# EAGLE design Sch_v5 (EAGLE 9.6.2)
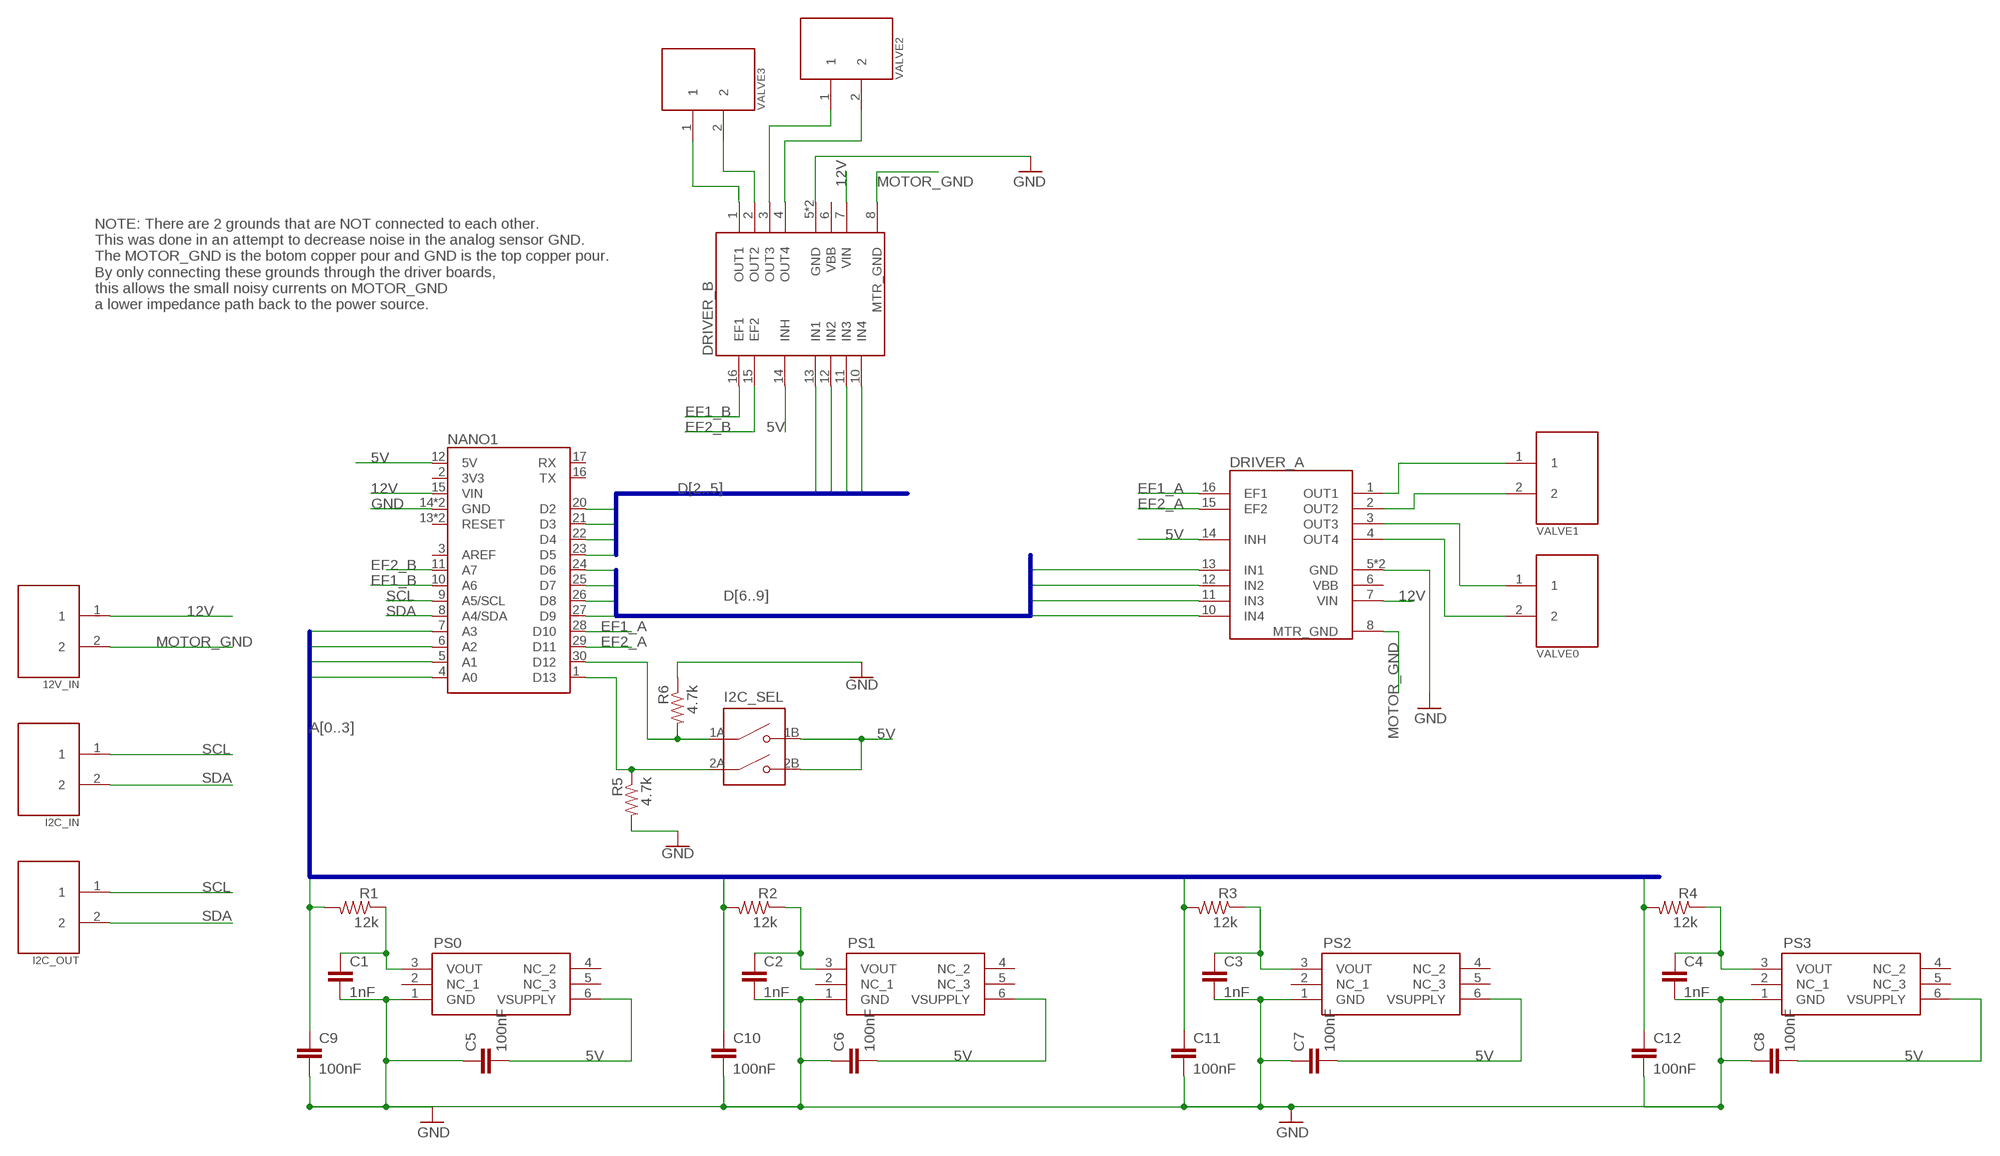
[diagram p0: schematic, sheet 1]

## Parts
12V_IN  PHOENIX_CONNECTOR_1778625  [PHOENIX_CONNECTOR_1778625]
C1  1nF  CERAMIC_CAPACITOR  [CERAMIC_CAPACITOR]
C2  1nF  CERAMIC_CAPACITOR  [CERAMIC_CAPACITOR]
C3  1nF  CERAMIC_CAPACITOR  [CERAMIC_CAPACITOR]
C4  1nF  CERAMIC_CAPACITOR  [CERAMIC_CAPACITOR]
C5  100nF  CERAMIC_CAPACITOR  [CERAMIC_CAPACITOR]
C6  100nF  CERAMIC_CAPACITOR  [CERAMIC_CAPACITOR]
C7  100nF  CERAMIC_CAPACITOR  [CERAMIC_CAPACITOR]
C8  100nF  CERAMIC_CAPACITOR  [CERAMIC_CAPACITOR]
C9  100nF  CERAMIC_CAPACITOR  [CERAMIC_CAPACITOR]
C10  100nF  CERAMIC_CAPACITOR  [CERAMIC_CAPACITOR]
C11  100nF  CERAMIC_CAPACITOR  [CERAMIC_CAPACITOR]
C12  100nF  CERAMIC_CAPACITOR  [CERAMIC_CAPACITOR]
DRIVER_A  A4990_DUAL_MOTOR_DRIVER_CARRIER  [A4990_DUAL_MOTOR_DRIVER_CARRIER]
DRIVER_B  A4990_DUAL_MOTOR_DRIVER_CARRIER  [A4990_DUAL_MOTOR_DRIVER_CARRIER]
I2C_IN  PHOENIX_CONNECTOR_1778625  [PHOENIX_CONNECTOR_1778625]
I2C_OUT  PHOENIX_CONNECTOR_1778625  [PHOENIX_CONNECTOR_1778625]
I2C_SEL  2PIN_DIP_DS01-254-S-02BE  [2PIN_DIP_DS01-254-S-02BE]
NANO1  ARDUINO_NANO_EVERY  [ARDUINO_NANO_EVERY]
PS0  PRESSURE_SENSOR_ABPDRNN100PGAA5  [PRESSURE_SENSOR_ABPDRNN100PGAA5]
PS1  PRESSURE_SENSOR_ABPDRNN100PGAA5  [PRESSURE_SENSOR_ABPDRNN100PGAA5]
PS2  PRESSURE_SENSOR_ABPDRNN100PGAA5  [PRESSURE_SENSOR_ABPDRNN100PGAA5]
PS3  PRESSURE_SENSOR_ABPDRNN100PGAA5  [PRESSURE_SENSOR_ABPDRNN100PGAA5]
R1  12k  R-US_0204/7  [0204/7]
R2  12k  R-US_0204/7  [0204/7]
R3  12k  R-US_0204/7  [0204/7]
R4  12k  R-US_0204/7  [0204/7]
R5  4.7k  R-US_0204/7  [0204/7]
R6  4.7k  R-US_0204/7  [0204/7]
VALVE0  PHOENIX_CONNECTOR_1778625  [PHOENIX_CONNECTOR_1778625]
VALVE1  PHOENIX_CONNECTOR_1778625  [PHOENIX_CONNECTOR_1778625]
VALVE2  PHOENIX_CONNECTOR_1778625  [PHOENIX_CONNECTOR_1778625]
VALVE3  PHOENIX_CONNECTOR_1778625  [PHOENIX_CONNECTOR_1778625]

## Nets
5V [Power]: C5.2 C6.2 C7.2 C8.2 DRIVER_A.14(INH) DRIVER_B.14(INH) I2C_SEL.1B(NO1) I2C_SEL.2B(NO2) NANO1.12(5V) PS0.6(VSUPPLY) PS1.6(VSUPPLY) PS2.6(VSUPPLY) PS3.6(VSUPPLY)
12V [Motor Power]: 12V_IN.1 DRIVER_A.7(VIN) DRIVER_B.7(VIN) NANO1.15(VIN)
A0 [Analog Signal]: C9.1 NANO1.4(A0) R1.2
A1 [Analog Signal]: C10.1 NANO1.5(A1) R2.2
A2 [Analog Signal]: C11.1 NANO1.6(A2) R3.2
A3 [Analog Signal]: C12.1 NANO1.7(A3) R4.2
D2: DRIVER_B.13(IN1) NANO1.20(D2)
D3: DRIVER_B.12(IN2) NANO1.21(D3)
D4: DRIVER_B.11(IN3) NANO1.22(D4)
D5: DRIVER_B.10(IN4) NANO1.23(D5)
D6: DRIVER_A.13(IN1) NANO1.24(D6)
D7: DRIVER_A.12(IN2) NANO1.25(D7)
D8: DRIVER_A.11(IN3) NANO1.26(D8)
D9: DRIVER_A.10(IN4) NANO1.27(D9)
EF1_A: DRIVER_A.16(EF1) NANO1.28(D10)
EF1_B: DRIVER_B.16(EF1) NANO1.10(A6)
EF2_A: DRIVER_A.15(EF2) NANO1.29(D11)
EF2_B: DRIVER_B.15(EF2) NANO1.11(A7)
GND: C1.2 C2.2 C3.2 C4.2 C5.1 C6.1 C7.1 C8.1 C9.2 C10.2 C11.2 C12.2 DRIVER_A.5(GND) DRIVER_A.9(GND) DRIVER_B.5(GND) DRIVER_B.9(GND) NANO1.14(GND) NANO1.19(GND) PS0.1(GND) PS1.1(GND) PS2.1(GND) PS3.1(GND) R5.2 R6.1
MOTOR_GND: 12V_IN.2 DRIVER_A.8(MTR_GND) DRIVER_B.8(MTR_GND)
N$1: C1.1 PS0.3(VOUT) R1.1
N$2: C2.1 PS1.3(VOUT) R2.1
N$3: C3.1 PS2.3(VOUT) R3.1
N$4: C4.1 PS3.3(VOUT) R4.1
N$5 [Valve Power]: DRIVER_A.2(OUT2) VALVE1.2
N$6 [Valve Power]: DRIVER_A.1(OUT1) VALVE1.1
N$7 [Valve Power]: DRIVER_A.3(OUT3) VALVE0.1
N$8 [Valve Power]: DRIVER_A.4(OUT4) VALVE0.2
N$9 [Valve Power]: DRIVER_B.1(OUT1) VALVE3.1
N$10 [Valve Power]: DRIVER_B.2(OUT2) VALVE3.2
N$11 [Valve Power]: DRIVER_B.3(OUT3) VALVE2.1
N$12 [Valve Power]: DRIVER_B.4(OUT4) VALVE2.2
N$13: I2C_SEL.1A(COM1) NANO1.30(D12) R6.2
N$14: I2C_SEL.2A(COM2) NANO1.1(D13) R5.1
SCL [I2C Bus]: I2C_IN.1 I2C_OUT.1 NANO1.9(A5/SCL)
SDA [I2C Bus]: I2C_IN.2 I2C_OUT.2 NANO1.8(A4/SDA)
Unconnected: DRIVER_A.6(VBB) DRIVER_B.6(VBB) NANO1.2(3V3) NANO1.3(AREF) NANO1.13(RESET) NANO1.16(TX) NANO1.17(RX) NANO1.18(RESET) PS0.2(NC_1) PS0.4(NC_2) PS0.5(NC_3) PS1.2(NC_1) PS1.4(NC_2) PS1.5(NC_3) PS2.2(NC_1) PS2.4(NC_2) PS2.5(NC_3) PS3.2(NC_1) PS3.4(NC_2) PS3.5(NC_3)

## Buses
A[0..3]
D[6..9]
D[2..5]

## Notes on the sheet
- NOTE: There are 2 grounds that are NOT connected to each other.
  This was done in an attempt to decrease noise in the analog sensor GND.
  The MOTOR_GND is the botom copper pour and GND is the top copper pour. 
  By only connecting these grounds through the driver boards,
  this allows the small noisy currents on MOTOR_GND 
  a lower impedance path back to the power source.

## Library data of the parts
12V_IN I2C_IN I2C_OUT VALVE0 VALVE1-VALVE3 = byu_pressure_control:PHOENIX_CONNECTOR_1778625: 2 Position Terminal Block Header, Male Pins, Shrouded (4 Side) 0.098" (2.50mm) 90°, Right Angle Through Hole Check prices <https://pricing.snapeda.com/parts/1778625/Phoenix%20Contact/view-part?ref=eda>; AVAILABILITY: Good; DESCRIPTION: 2 Position Terminal Block Header, Male Pins, Shrouded (4 Side) 0.098 (2.50mm) 90°, Right Angle Through Hole; MF: Phoenix Contact; MP: 1778625; PACKAGE: None; PRICE: None; PURCHASE-URL: https://pricing.snapeda.com/search/part/1778625/?ref=eda
C1-C12 = byu_pressure_control:CERAMIC_CAPACITOR: Ceramic capacitors A capacitor is a passive two-terminal electrical component used to store electrical energy temporarily in an electric field.
DRIVER_A DRIVER_B = byu_pressure_control:A4990_DUAL_MOTOR_DRIVER_CARRIER: A4990 Dual Motor Driver Carrier (Pololu) Link <https://www.pololu.com/product/2137> Important Note: The schematic for this part indicates that there is a GND and MTR_GND (Motor ground) that are separate. This is not actually the case on the real board where all of the ground pins are connected to each other. They were separated out here to enable each GND and MTR_GND to be connected to different ground pours on the PCB to minimize noise on the analog sensors which will use the GND plane. Once these driver boards are plugged into the PCB, they connect the ground pours to each other to ensure one common ground in the pcb.
I2C_SEL = byu_pressure_control:2PIN_DIP_DS01-254-S-02BE; CUI_PURCHASE_URL: https://www.cuidevices.com/product/switches/dip-switches/ds01-254-series?utm_source=snapeda.com&utm_medium=referral&utm_campaign=snapedaBOM; DESCRIPTION: 2 Position, Through Hole, 2.54 mm Pitch, Raised Slide Actuator, Flat Bottom, Short Pin, DIP Switch; DIGI-KEY_PART_NUMBER: 2223-DS01-254-S-02BE-ND; MF: CUI Devices; MP: DS01-254-S-02BE; PACKAGE: None; PURCHASE-URL: https://pricing.snapeda.com/search/part/DS01-254-S-02BE/?ref=eda
NANO1 = byu_pressure_control:ARDUINO_NANO_EVERY: Arduino Nano Every Website <https://store.arduino.cc/usa/nano-every> The Nano Every is Arduino’s 5V compatible board in the smallest available form factor: 45x18mm! The Arduino Nano is the preferred board for many projects requiring a small and easy to use microcontroller board. The small footprint and low price, make the Nano Every particularly suited for wearable inventions, low-cost robotics, electronic musical instruments, and general use to control smaller parts of larger projects. The Arduino Nano Every is an evolution of the traditional Arduino Nano board but features a lot more powerful processor, the ATMega4809. This will allow you to make larger programs than with the Arduino Uno (it has 50% more program memory), and with a lot more variables (the RAM is 200% bigger).; WEBSITE: https://store.arduino.cc/usa/nano-every
PS0 PS1-PS3 = byu_pressure_control:PRESSURE_SENSOR_ABPDRNN100PGAA5: Honeywell Pressure Sensor (ABPDRNN100PGAA5) Link <https://www.mouser.com/ProductDetail/Honeywell/ABPDRNN100PGAA5?qs=sGAEpiMZZMvhQj7WZhFIAD2P7qVC0dZ7tI11ZYAVyGqQk%2FMhVJdgGw%3D%3D>; DESCRIPTION: Board Mount Pressure Sensors BASIC PRESSURE SENSOR; HEIGHT: 7.61mm; MANUFACTURER_NAME: Honeywell; MANUFACTURER_PART_NUMBER: ABPDRNN100PGAA5; MOUSER_PART_NUMBER: 785-ABPDRNN100PGAA5; MOUSER_PRICE-STOCK: https://www.mouser.co.uk/ProductDetail/Honeywell/ABPDRNN100PGAA5?qs=YCa%2FAAYMW03EAlFoRyu6VA%3D%3D
R1-R6 = rcl:R-US_: RESISTOR, American symbol; SPICEPREFIX: R

## Net classes
1 Power: width 0.305 mm, drill 0.305 mm
2 Motor Power: width 2.032 mm, drill 2.032 mm, clearance 0.508 mm to class 0
3 Analog Signal: clearance 0.762 mm to class 2, clearance 0.127 mm
4 I2C Bus: clearance 0.762 mm to class 2, clearance 0.254 mm to class 3
5 Valve Power: width 0.762 mm, drill 0.762 mm, clearance 0.508 mm to class 3, clearance 0.508 mm to class 4

## Board
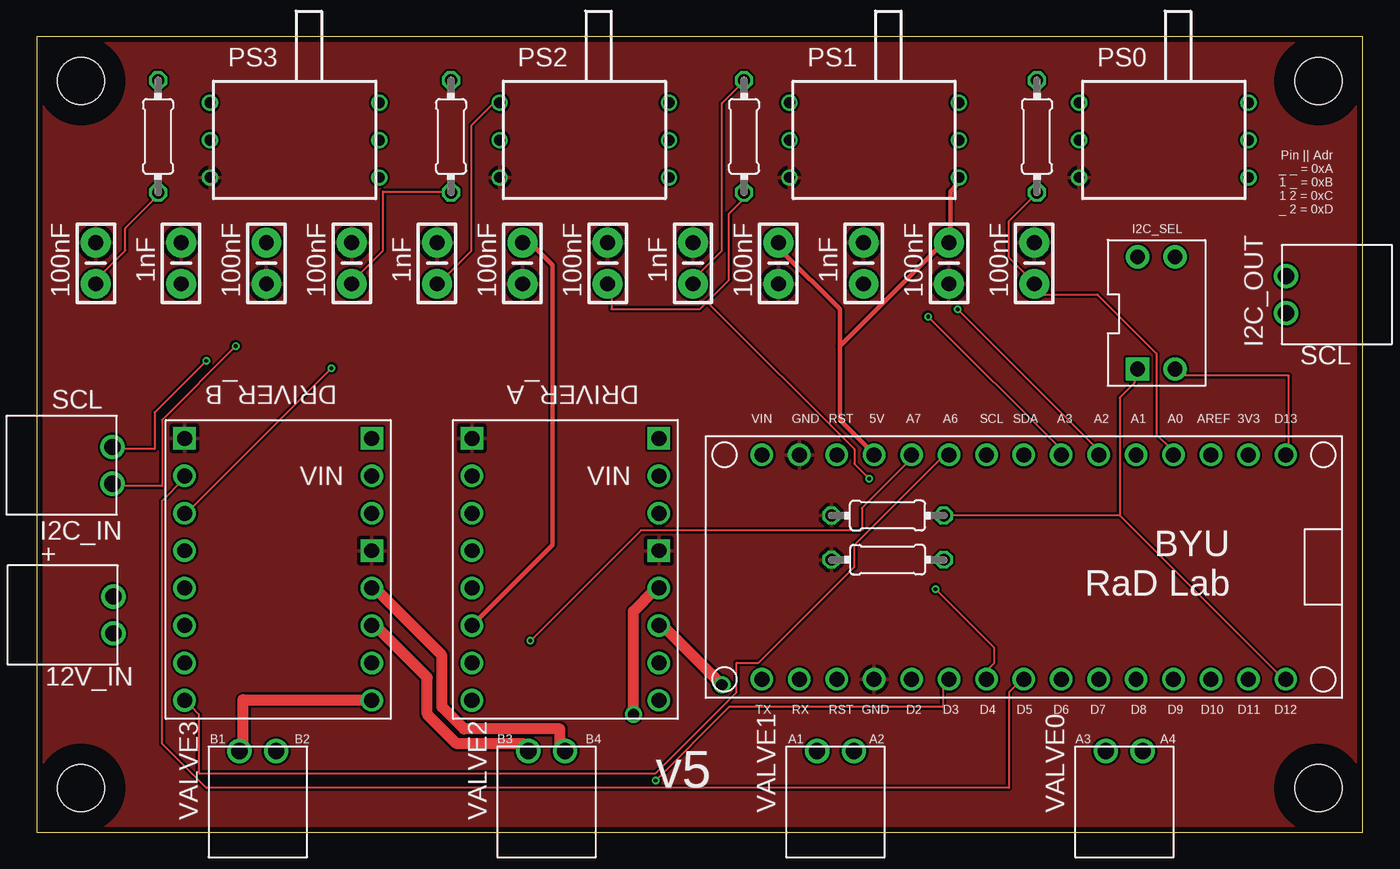
[diagram p1: board, top side]
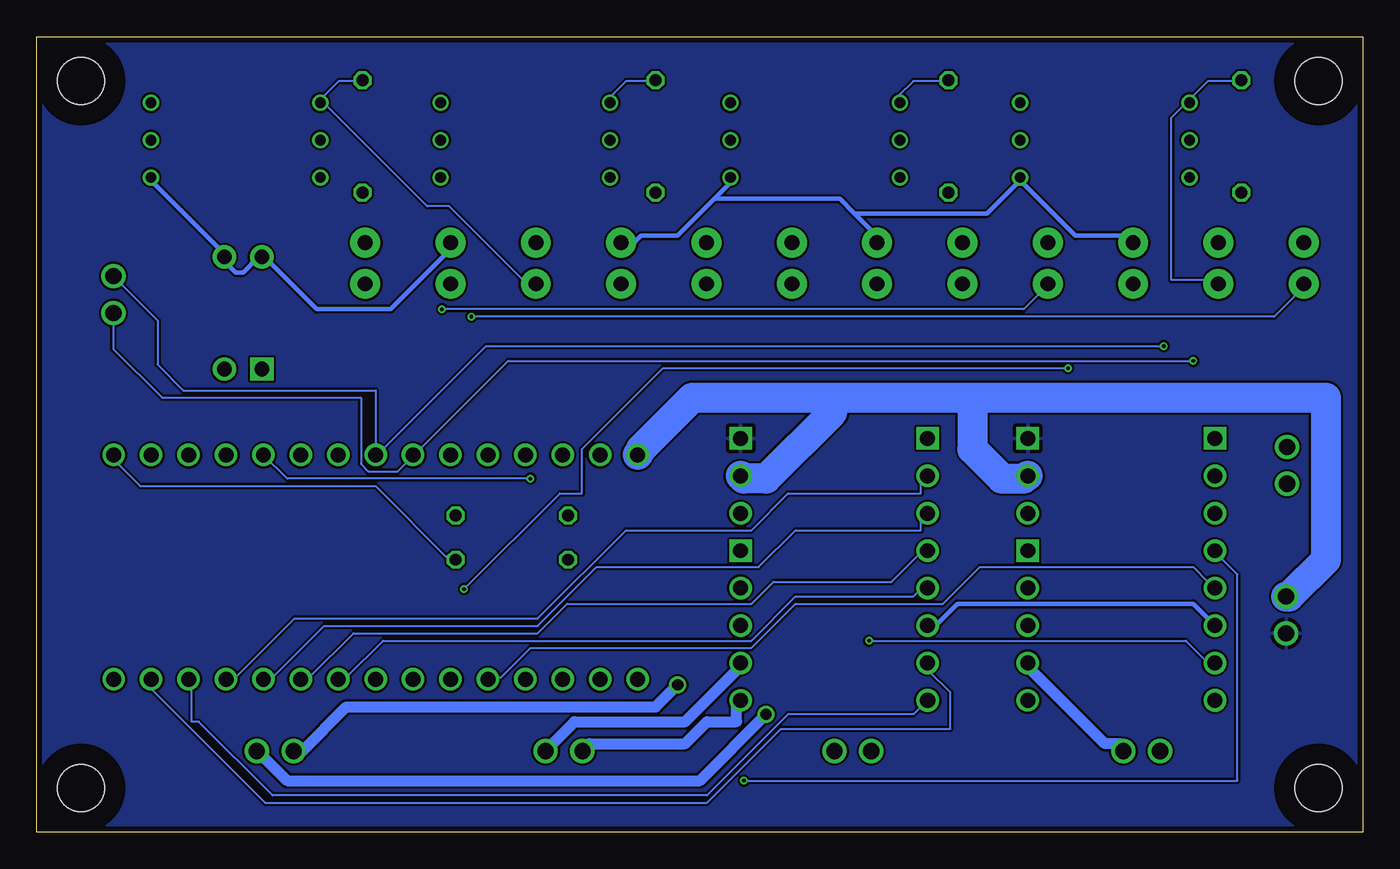
[diagram p2: board, bottom side, seen from below]

Size 90 x 54 mm. Coordinates in mm from the lower left corner, seen from the top.
Outline: 0,54 0,0 90,0 90,54 0,54
Copper layers (1*16): Top 0.035559375mm / dielectric 1.6mm / Bottom 0.035559375mm
Design rules "oshpark-2layer": minimum track width 6mil, minimum drill 10mil, track to track 6mil, track to pad 6mil, pad to pad 6mil, via to via 6mil, smd to smd 6mil, copper to edge 15mil, drill to drill 6mil, minimum pad ring 5mil, minimum via ring 5mil, stop-mask expansion 2.5mil, vias tented up to drill 0mil, thermal gap 10mil
Holes 3.2 mm at 3,51 3,3 87,51 87,3
tKeepout: area 0,48 to 6,54; area 0,0 to 6,6; area 84,48 to 90,54; area 84,0 to 90,6
bKeepout: area 0,48 to 6,54; area 0,0 to 6,6; area 84,48 to 90,54; area 84,0 to 90,6
tRestrict: area 0,48 to 6,54; area 0,0 to 6,6; area 84,48 to 90,54; area 84,0 to 90,6
bRestrict: area 0,48 to 6,54; area 0,0 to 6,6; area 84,48 to 90,54; area 84,0 to 90,6
vRestrict: area 0,48 to 6,54; area 0,0 to 6,6; area 84,48 to 90,54; area 84,0 to 90,6

### Footprints (pad centres in the part's own frame; a part is rotated, then mirrored left to right if it is on the bottom)
PHOENIX_CONNECTOR_1778625 = drill 1.1: 1 -1.25,7.2; 2 1.25,7.2
CERAMIC_CAPACITOR = drill 1.016 pad 2.032: 1 -1.397,0; 2 1.397,0
A4990_DUAL_MOTOR_DRIVER_CARRIER = drill 1.016: 1 1.27,19.05; 2 1.27,16.51; 3 1.27,13.97; 4 1.27,11.43; 6 1.27,6.35; 7 1.27,3.81; 10 13.97,3.81; 11 13.97,6.35; 12 13.97,8.89; 13 13.97,11.43; 14 13.97,13.97; 15 13.97,16.51 | drill 1.016 square: 5 1.27,8.89; 8 1.27,1.27; 9 13.97,1.27 | drill 1.026: 16 13.97,19.05
2PIN_DIP_DS01-254-S-02BE = drill 1 pad 1.58 square: 1A -1.27,-3.81 | drill 1 pad 1.58: 1B -1.27,3.81; 2A 1.27,-3.81; 2B 1.27,3.81
ARDUINO_NANO_EVERY = drill 1.016: 1 -7.62,17.78; 2 -7.62,15.24; 3 -7.62,12.7; 4 -7.62,10.16; 5 -7.62,7.62; 6 -7.62,5.08; 7 -7.62,2.54; 8 -7.62,0; 9 -7.62,-2.54; 10 -7.62,-5.08; 11 -7.62,-7.62; 12 -7.62,-10.16; 13 -7.62,-12.7; 14 -7.62,-15.24; 15 -7.62,-17.78; 16 7.62,-17.78; 17 7.62,-15.24; 18 7.62,-12.7; 19 7.62,-10.16; 20 7.62,-7.62; 21 7.62,-5.08; 22 7.62,-2.54; 23 7.62,0; 24 7.62,2.54; 25 7.62,5.08; 26 7.62,7.62; 27 7.62,10.16; 28 7.62,12.7; 29 7.62,15.24; 30 7.62,17.78
PRESSURE_SENSOR_ABPDRNN100PGAA5 = drill 0.73: 1 6.55,-0.25; 2 4.01,-0.25; 3 1.47,-0.25; 4 1.47,11.25; 5 4.01,11.25; 6 6.55,11.25
0204/7 = drill 0.813 octagon: 1 -3.81,0; 2 3.81,0

### Placement (x,y rotation side)
12V_IN  -2,14.75 270 top
C1  56.13,38.62 90 top
C2  44.54,38.62 90 top
C3  27.17,38.62 90 top
C4  9.79,38.62 90 top
C5  15.58,38.62 90 top
C6  32.96,38.62 90 top
C7  61.92,38.62 90 top
C8  50.34,38.62 90 top
C9  67.71,38.62 90 top
C10  38.75,38.62 90 top
C11  21.38,38.62 90 top
C12  4,38.62 90 top
DRIVER_A  43.5,28 180 top
DRIVER_B  24,28 180 top
I2C_IN  -2.07,24.91 270 top
I2C_OUT  92,36.5 90 top
I2C_SEL  76,35.25 0 top
NANO1  67,18 270 top
PS0  71,51 270 top
PS1  51.33,51 270 top
PS2  31.67,51 270 top
PS3  12,51 270 top
R1  67.89,47.24 270 top
R2  48,47.24 270 top
R3  28.12,47.24 270 top
R4  8.23,47.24 270 top
R5  57.75,18.5 180 top
R6  57.75,21.5 0 top
VALVE0  73.82,-1.69 0 top
VALVE1  54.21,-1.69 0 top
VALVE2  34.61,-1.69 0 top
VALVE3  15,-1.69 0 top

### Tracks (layer width: path | path; a pad name or v marks a point on that pad's centre or on a via)
5V
  Top 0.305: PS1.6 62.5,44 62,43.5 62,40.5 C7.2 61.5,40 54.5,33 | 54.5,33 54.5,35.5 50.5,39.5 50.5,40 C8.2 | 54.5,33 54.5,28 56.5,26 NANO1.12 | DRIVER_A.14 35,19.5 35,38.5 33,40.5 C6.2
  Bottom 0.305: DRIVER_B.14 11.5,15.5 27.5,15.5 29,14 29.5,14 DRIVER_A.14 | C5.2 16,40.5 19.5,40.5 23,44 PS3.6 23.5,44 25.5,42 34.5,42 | PS0.6 82,44 77.5,39.5 I2C_SEL.2B 77.5,39 76.5,38 76,38 75,39 I2C_SEL.1B 74.5,39 71,35.5 66,35.5 61.5,40 C7.2 | 44,43 46.5,40.5 49,40.5 49.5,40 50,40 C8.2 | 44,43 43,44 PS2.6 | 34.5,42 35.5,43 44,43 | 34.5,42 33,40.5 C6.2
12V
  Bottom 2.032: 26.5,29.5 26.5,26 24.5,24 23,24 DRIVER_B.7 | 36,29.5 45.5,29.5 49,26 NANO1.15 | 36,29.5 26.5,29.5 | DRIVER_A.7 42,24 40.5,24 36,28.5 36,29.5 | 26.5,29.5 2.5,29.5 2.5,18.5 5,16 12V_IN.1
A0
  Top 0.152: R1.2 67.5,43 66,41.5 66,39 67.5,37.5 C9.1 68,37 68,36.5 72,36.5 76,32.5 76,27 77,26 NANO1.4
A1  (via drill 0.25)
  Top 0.152: 45.5,36 45,35.5 39,35.5 39,37 C10.1 | 45.5,36 47,37.5 47,42 48,43 R2.2 | v56.5,24 55.5,25 55.5,26 45.5,36
  Bottom 0.152: NANO1.5 73,24 v56.5,24
A2  (via drill 0.25)
  Top 0.152: R3.2 28,43.5 23.5,43.5 23.5,39.5 21.5,37.5 C11.1 | v62.5,35.5 72,26 NANO1.6
  Bottom 0.152: v62.5,35.5 23,35.5 21.5,37 C11.1
A3  (via drill 0.25)
  Top 0.152: R4.2 8,43 6,41 6,39.5 4,37.5 C12.1 | v60.5,35 69.5,26 NANO1.7
  Bottom 0.152: v60.5,35 6,35 4,37 C12.1
D2
  Bottom 0.152: DRIVER_B.13 10.5,17 11.5,18 26,18 28.5,15.5 38.5,15.5 41.5,12.5 56.5,12.5 58.5,10.5 59,10.5 NANO1.20
D3  (via drill 0.25)
  Top 0.152: v42,3.5 47,8.5 61.5,8.5 61.5,10 NANO1.21
  Bottom 0.152: v42,3.5 8.5,3.5 8.5,17.5 10,19 DRIVER_B.12
D4  (via drill 0.25)
  Top 0.152: v20,31.5 10.5,22 DRIVER_B.11 | v61,16.5 65,12.5 65,11.5 64.5,11 64.5,10.5 NANO1.22
  Bottom 0.152: v20,31.5 47.5,31.5 53,26 53,23 54.5,23 v61,16.5
D5
  Top 0.152: DRIVER_B.10 10,24 8.5,22.5 8.5,6 11.5,3 66,3 66,9.5 67,10.5 NANO1.23
D6
  Bottom 0.152: DRIVER_A.13 30,16.5 30.5,16 38.5,16 41.5,13 66.5,13 69,10.5 69.5,10.5 NANO1.24
D7
  Bottom 0.152: DRIVER_A.12 30,19 32,17 40,17 41.5,15.5 54,15.5 56,13.5 68.5,13.5 71.5,10.5 72,10.5 NANO1.25
D8
  Bottom 0.152: DRIVER_A.11 30,21.5 30,20.5 38.5,20.5 41,18 52,18 56,14 70.5,14 74,10.5 74.5,10.5 NANO1.26
D9
  Bottom 0.152: DRIVER_A.10 30,24 30,23 39,23 41.5,20.5 50,20.5 56,14.5 72.5,14.5 76.5,10.5 77,10.5 NANO1.27
EF1_A
  Bottom 0.152: NANO1.28 79.5,10 79.5,7.5 79,7.5 74,2.5 44.5,2.5 39,8 30.5,8 30,8.5 DRIVER_A.16
EF1_B
  Top 0.152: NANO1.10 61.5,25.5 55.5,19.5 55.5,18 49,11.5 47.5,11.5 47.5,9.5 42,4 11,4 11,8 10.5,8.5 DRIVER_B.16
EF2_A
  Bottom 0.152: DRIVER_A.15 29.5,11 28,9.5 28,7 39.5,7 44.5,2 74.5,2 82.5,10 NANO1.29
EF2_B  (via drill 0.25)
  Top 0.152: v33.5,13 41,20.5 56,20.5 56,22 59,25 59,25.5 NANO1.11
  Bottom 0.152: v33.5,13 12,13 10.5,11.5 DRIVER_B.15
GND
  pour Top: 0,54 0,0 90,0 90,54
MOTOR_GND
  pour Bottom: 0,54 0,0 90,0 90,54
N$1
  Bottom 0.152: R1.1 68,51 69.5,51 70.5,50 PS0.3 70.5,49.5 63.5,42.5 62,42.5 57,37.5 56.5,37.5 C1.1
N$2
  Top 0.152: R2.1 48,51 46.5,49.5 46.5,39.5 45,38 45,37.5 C2.1
  Bottom 0.152: PS1.3 51,50 50,51 48.5,51 R2.1
N$3
  Top 0.152: PS2.3 31,49.5 29.5,48 29.5,39.5 27.5,37.5 C3.1
  Bottom 0.152: PS2.3 31.5,50 30.5,51 28.5,51 R3.1
N$4
  Bottom 0.152: R4.1 8.5,51 10.5,51 11.5,50 PS3.3 12,49.5 13,48.5 13,37.5 10,37.5 C4.1
N$5
  Bottom 0.762: DRIVER_A.2 42.5,11 46,7.5 53.5,7.5 55,6 VALVE1.2
N$6
  Bottom 0.762: DRIVER_A.1 42.5,8.5 42.5,7.5 44.5,7.5 46,6 52.5,6 VALVE1.1
N$7  (via drill 0.76)
  Top 0.762: v46.5,10 42.5,14 DRIVER_A.3
  Bottom 0.762: v46.5,10 48,8.5 69,8.5 72,5.5 72.5,5.5 VALVE0.1
N$8  (via drill 0.76)
  Top 0.762: v40.5,8 40.5,15 42,16.5 DRIVER_A.4
  Bottom 0.762: v40.5,8 45,3.5 73,3.5 75,5.5 VALVE0.2
N$9
  Top 0.762: DRIVER_B.1 22.5,9 14,9 14,6 VALVE3.1
N$10
  Bottom 0.762: DRIVER_B.2 22.5,11 17.5,6 16.5,6 VALVE3.2
N$11
  Top 0.762: DRIVER_B.3 23,14 26.5,10.5 26.5,8 28.5,6 33,6 VALVE2.1
N$12
  Top 0.762: DRIVER_B.4 23,16.5 27.5,12 27.5,8.5 29,7 35.5,7 35.5,6 VALVE2.2
N$13
  Top 0.152: 73.5,21.5 R6.2 | 73.5,21.5 73.5,29.5 74.5,30.5 74.5,31 I2C_SEL.1A | 73.5,21.5 84.5,10.5 NANO1.30
N$14
  Top 0.152: I2C_SEL.2A 77.5,31 85,31 85,26 NANO1.1
  Bottom 0.152: R5.1 62,18.5 67,23.5 83,23.5 85,25.5 NANO1.1
SCL  (via drill 0.25)
  Top 0.152: v11.5,32 8,28.5 8,26 5.5,26 I2C_IN.1
  Bottom 0.152: I2C_OUT.1 84.8,32.8 81.5,29.5 68,29.5 68,25 67.5,24.5 65.5,24.5 64.5,25.5 NANO1.9 64,26 58,32 v11.5,32
SDA  (via drill 0.25)
  Top 0.152: v13.5,33 8.5,28 8.5,23.5 5.5,23.5 I2C_IN.2
  Bottom 0.152: 67,26 67,30 80.05,30 81.8,31.75 81.8,34.75 I2C_OUT.2 | v13.5,33 59.5,33 66.5,26 67,26 | 67,26 NANO1.8

### Text on the board
tPlace: Pin || Adr / _ _ = 0xA / 1 _ = 0xB / 1 2 = 0xC / _ 2 = 0xD | SCL | SCL | VIN | GND | RST | 5V | A7 | A6 | SCL | SDA | A3 | A2 | A1 | A0 | AREF | 3V3 | D13 | BYU / RaD Lab | + | TX | RX | RST | GND | D2 | D3 | D4 | D5 | D6 | D7 | D8 | D9 | D10 | D11 | D12 | B1 | B2 | B3 | B4 | A1 | A2 | A3 | A4 | v5
tValues: v5